# Altium schematic sheet REUN.941613.002_Diode_Coagulator_E4.SchDoc: Диодный лазерный
size 840 x 594 mm; Date: 08.06.23; ApprovedBy: Шавликов; CheckedBy: Мамаев; DrawnBy: Подлесный; DocumentNumber: РЕУН.941613.002 Э4 2D; SheetNumber: пусто если лист 1, иначе 1; SheetTotal: количество листов; Title1str: 2-х волновой коагулятор; DocumentType: тип схемы; Format: A1; ImagePath: РЕУН.941613.002 ТЭ
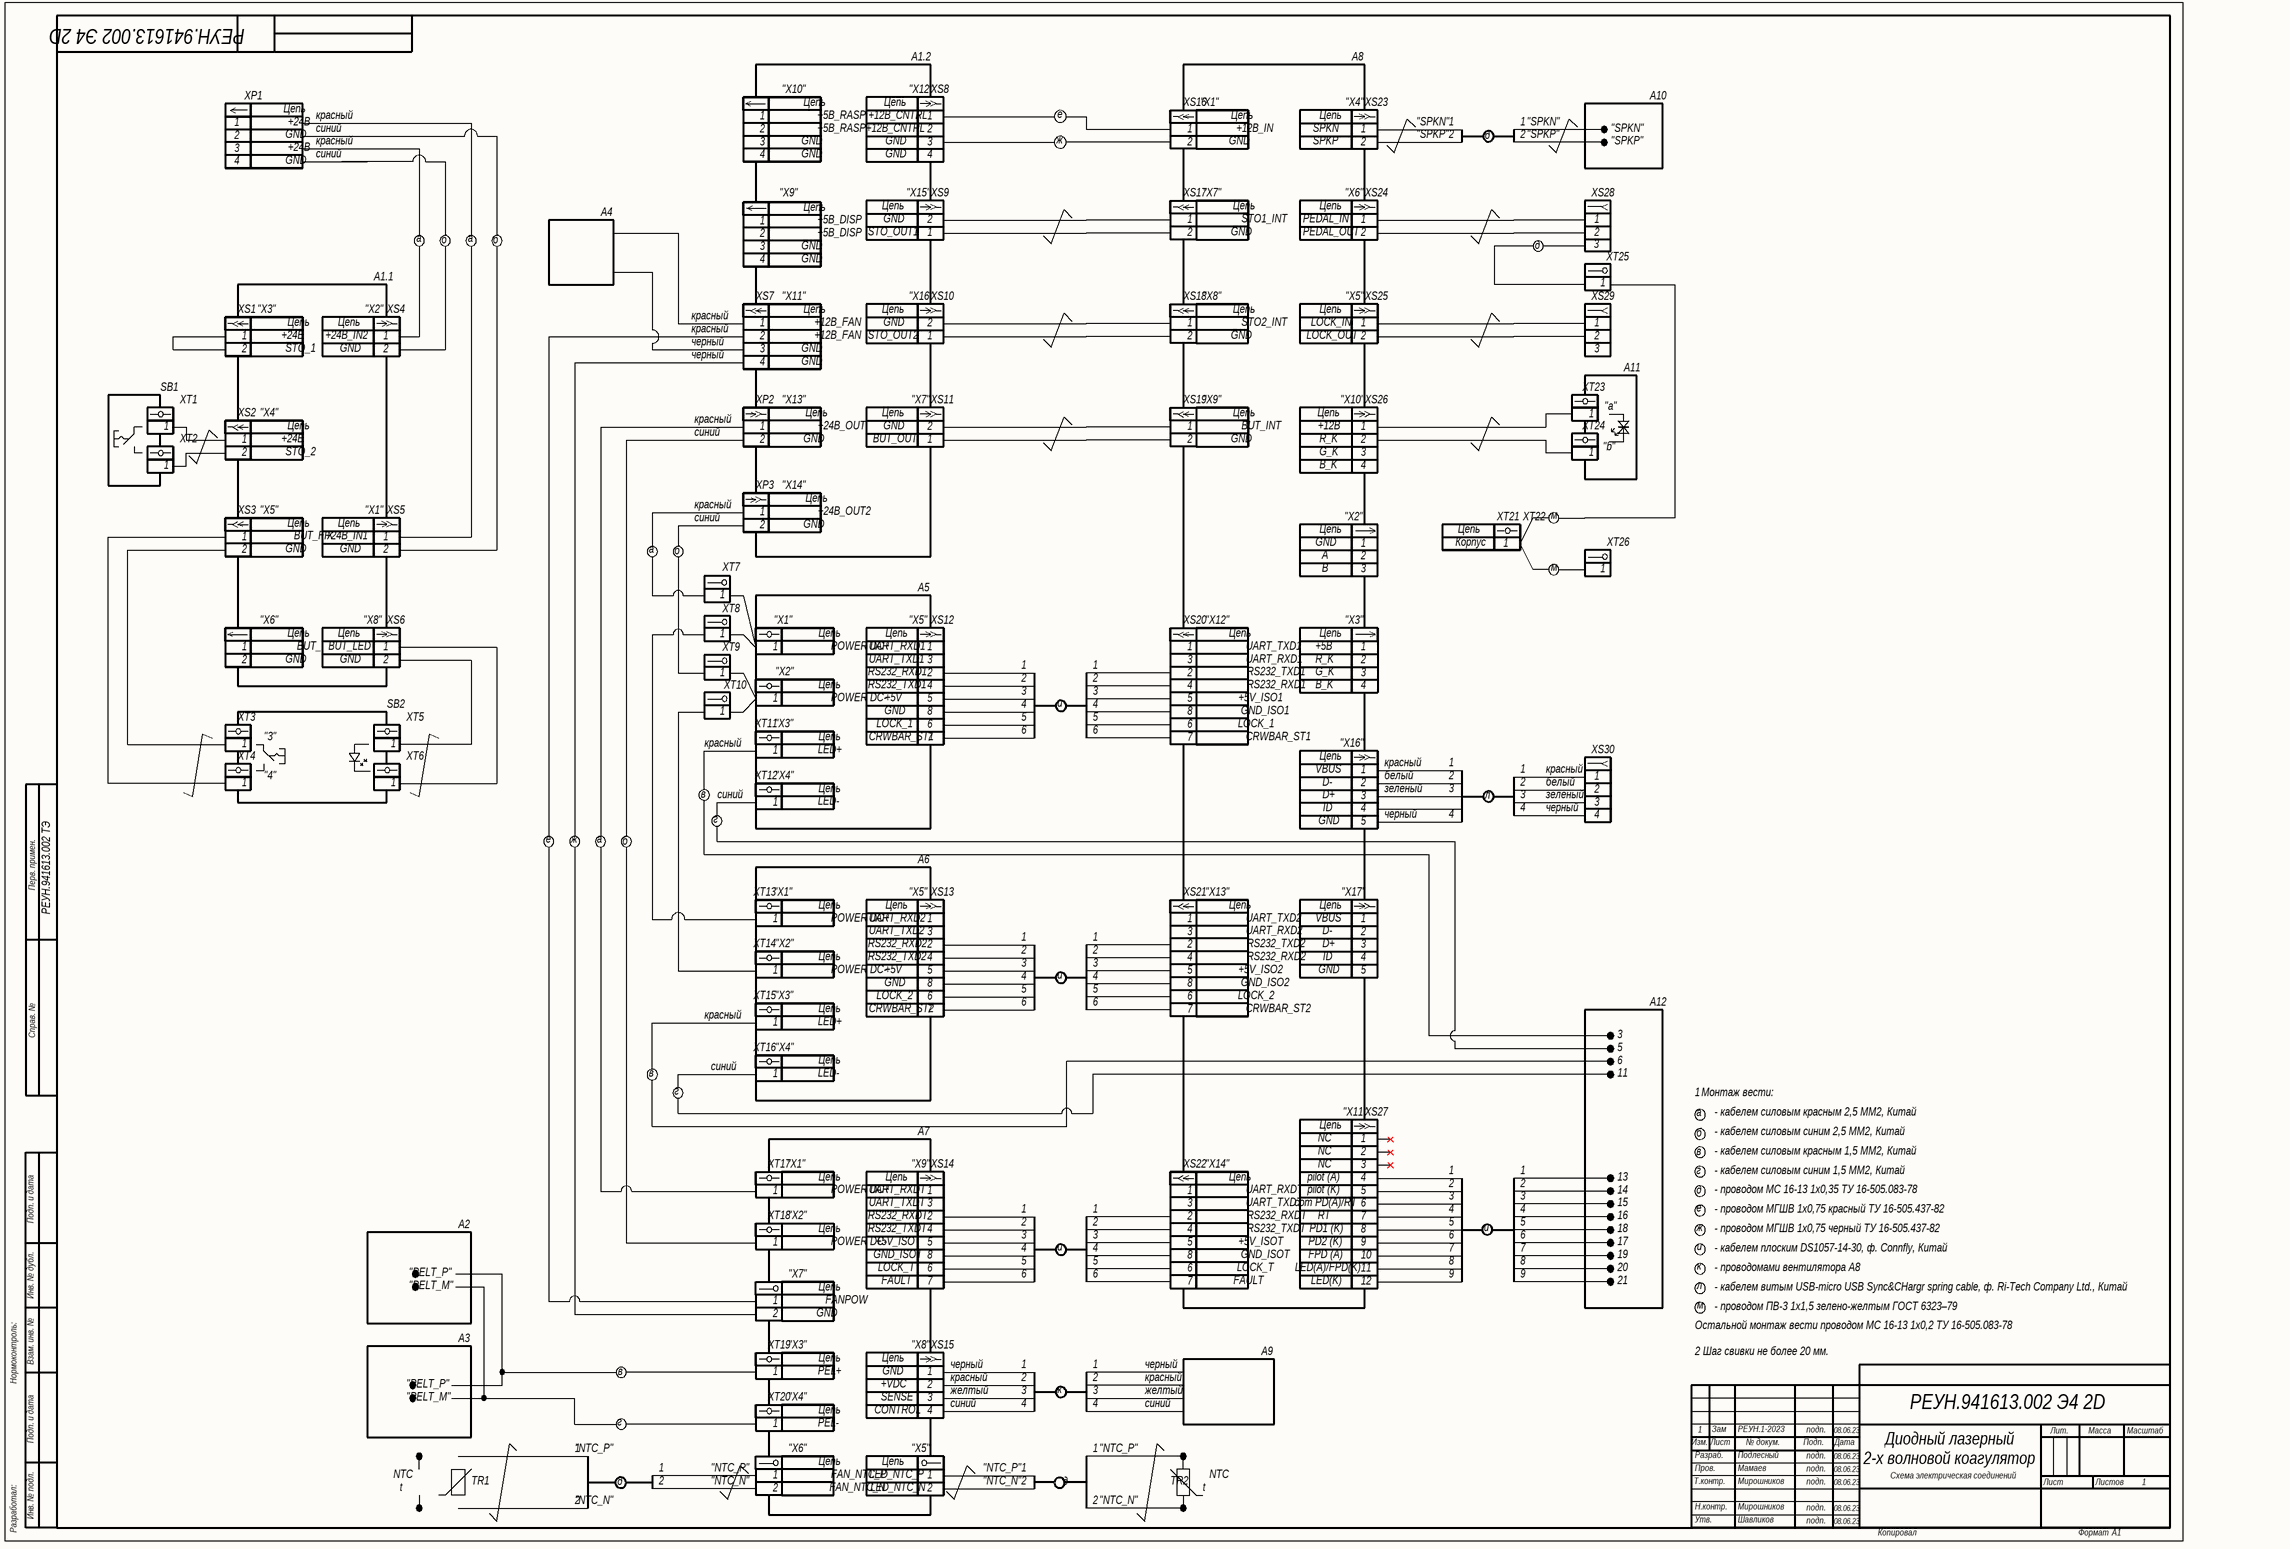
[diagram p0: REUN.941613.002_Diode_Coagulator_E4.SchDoc]

## Notes on the sheet
- А1.2
- А8
- XP1
- "X10"
- Цепь
- "X12"
- XS8
- XS16
- "X1"
- "X4"
- XS23
- A10
- 1
- 2
- GND
- +24В
- +5B_RASP
- +12B_CNTRL
- е
- +12B_IN
- SPKN
- "SPKN"
- "SPKP"
- 3
- 4
- +24B
- ж
- SPKP
- д
- "X9"
- "X15"
- XS9
- XS17
- "X7"
- "X6"
- XS24
- XS28
- A4
- +5B_DISP
- STO_OUT1
- STO1_INT
- PEDAL_IN
- PEDAL_OUT
- a
- б
- XT25
- А1.1
- XS7
- "X11"
- "X16"
- XS10
- XS18
- "X8"
- "X5"
- XS25
- XS29
- XS1
- "X3"
- "X2"
- XS4
- +12B_FAN
- STO2_INT
- LOCK_IN
- STO_1
- +24B_IN2
- STO_OUT2
- LOCK_OUT
- SB1
- XT23
- A11
- XT1
- XS2
- XP2
- "X13"
- +24B_OUT1
- XS11
- XS19
- BUT_INT
- +12B
- XS26
- XT24
- XT2
- STO_2
- BUT_OUT
- G_K
- R_K
- XP3
- "X14"
- B_K
- XS3
- XS5
- +24B_OUT2
- XT21
- XT22
- м
- BUT_FIX
- +24B_IN1
- A
- Корпус
- XT26
- XT7
- A5
- B
- "Х8"
- XS6
- XT8
- XS12
- XS20
- BUT_NFIX
- BUT_LED
- XT9
- POWER DC+
- UART_RXD1
- UART_TXD1
- +5B
- XT10
- RS232_TXD1
- RS232_RXD1
- XT3
- SB2
- XT5
- XT11
- POWER DC-
- LOCK_1
- +5V
- 5
- 6
- 8
- и
- +5V_ISO1
- GND_ISO1
- XT4
- "3"
- XT6
- LED+
- CRWBAR_ST1
- 7
- XS30
- "4"
- XT12
- VBUS
- D-
- в
- г
- LED-
- D+
- ID
- л
- Перв. примен.
- A6
- XT13
- UART_RXD2
- XS13
- XS21
- UART_TXD2
- "X17"
- XT14
- RS232_TXD2
- RS232_RXD2
- +5V_ISO2
- GND_ISO2
- Справ. №
- XT15
- CRWBAR_ST2
- LOCK_2
- A12
- XT16
- 11
- XS27
- Монтаж вести:
- - кабелем силовым красным 2,5 ММ2, Китай
- A7
- NC
- - кабелем силовым красным 1,5 ММ2, Китай
- - кабелем силовым синим 2,5 ММ2, Китай
- XT17
- XS14
- XS22
- pilot (A)
- 13
- - кабелем силовым синим 1,5 ММ2, Китай
- Подп. и дата
- XT18
- RS232_RXDT
- UART_RXDT
- UART_TXDT
- com PD(A)/RT
- pilot (K)
- RT
- 14
- 16
- 15
- - проводом МС 16-13 1х0,35 ТУ 16-505.083-78
- - проводом МГШВ 1х0,75 красный ТУ 16-505.437-82
- A2
- RS232_TXDT
- +5V_ISOT
- PD2 (K)
- PD1 (K)
- 9
- 18
- 17
- - кабелем плоским DS1057-14-30, ф. Connfly, Китай
- - проводом МГШВ 1х0,75 черный ТУ 16-505.437-82
- Инв. № дубл.
- "PELT_M"
- "PELT_P"
- GND_ISOT
- LOCK_T
- FAULT
- LED(A)/FPD(K)
- FPD (A)
- LED(K)
- 10
- 12
- 20
- 19
- 21
- к
- - проводомами вентилятора А8
- FANPOW
- - кабелем витым USB-micro USB Sync&CHargr spring cable, ф. Ri-Tech Company Ltd., Китай
- - проводом ПВ-3 1х1,5 зелено-желтым ГОСТ 6323–79
- Нормоконтроль:
- Взам. инв. №
- A3
- XT19
- XS15
- A9
- 2 Шаг свивки не более 20 мм.
- Остальной монтаж вести проводом МС 16-13 1х0,2 ТУ 16-505.083-78
- PEL+
- +VDC
- XT20
- CONTROL
- SENSE
- "NTC_P"
- PEL-
- Изм.
- Зам
- Лист
- РЕУН.1-2023
- № докум.
- подп.
- Подп.
- Дата
- Лит.
- Масса
- Масштаб
- NTC
- TR1
- "NTC_N"
- FAN_NTC_P
- LED_NTC_P
- TR2
- Т.контр.
- Пров.
- Разраб.
- Мирошников
- Схема электрическая соединений
- Листов
- Разработал:
- Инв. № подл.
- t
- FAN_NTC_N
- LED_NTC_N
- Н.контр.
- Утв.
- Копировал
- Формат
- Labels drawn without touching a wire or pin: 1, 2, 3, 4, 5, 6, 7, 8, 9, "a", "b", белый, желтый, зеленый, красный, синий, черный